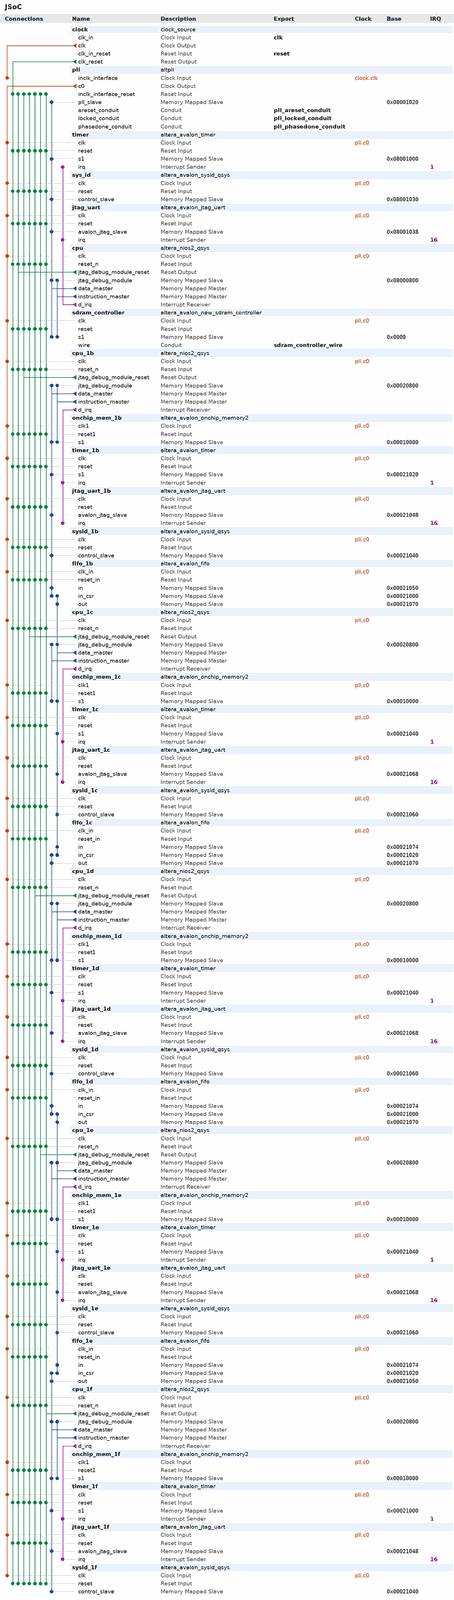
[diagram p0: system contents, whole]
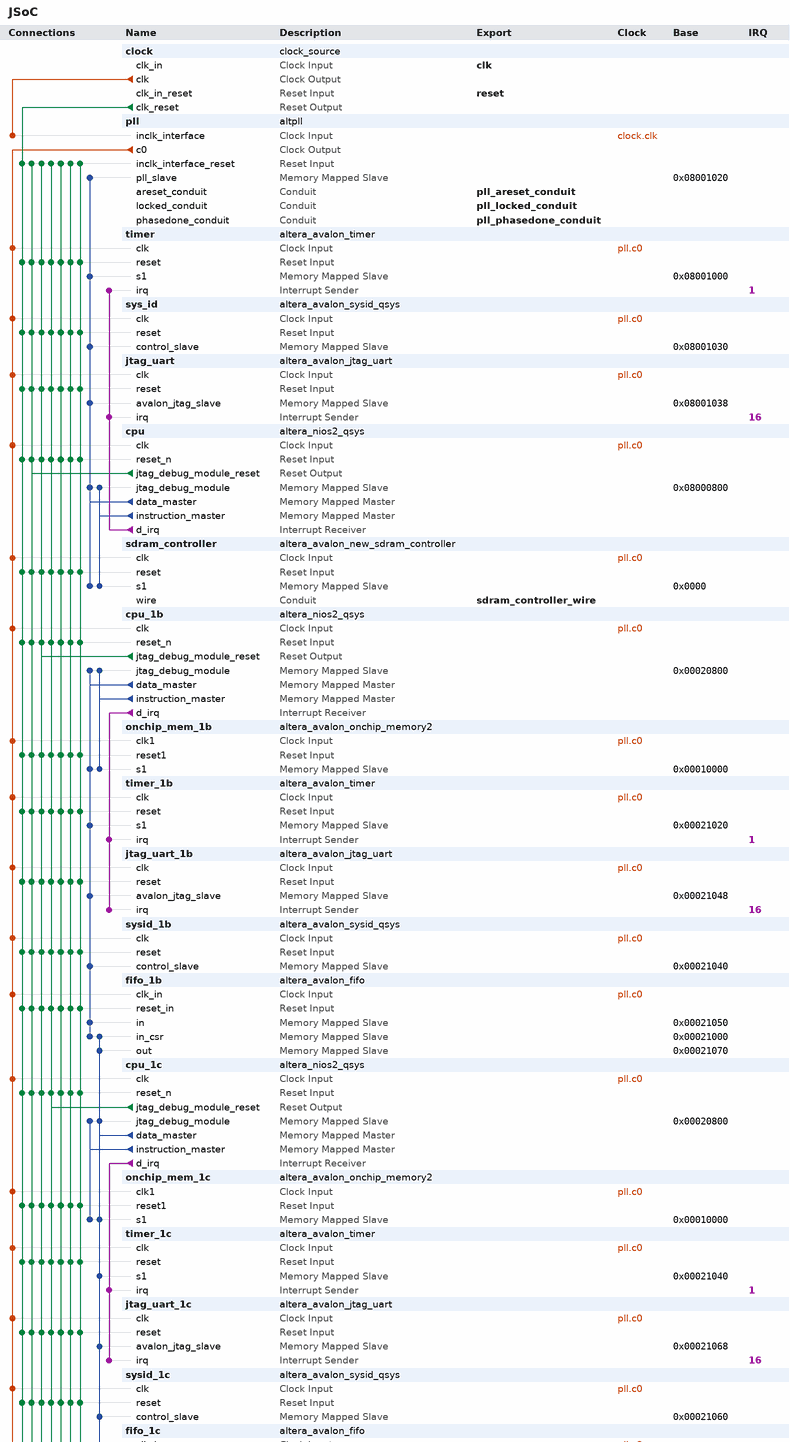
[diagram p1: system contents, upper part]
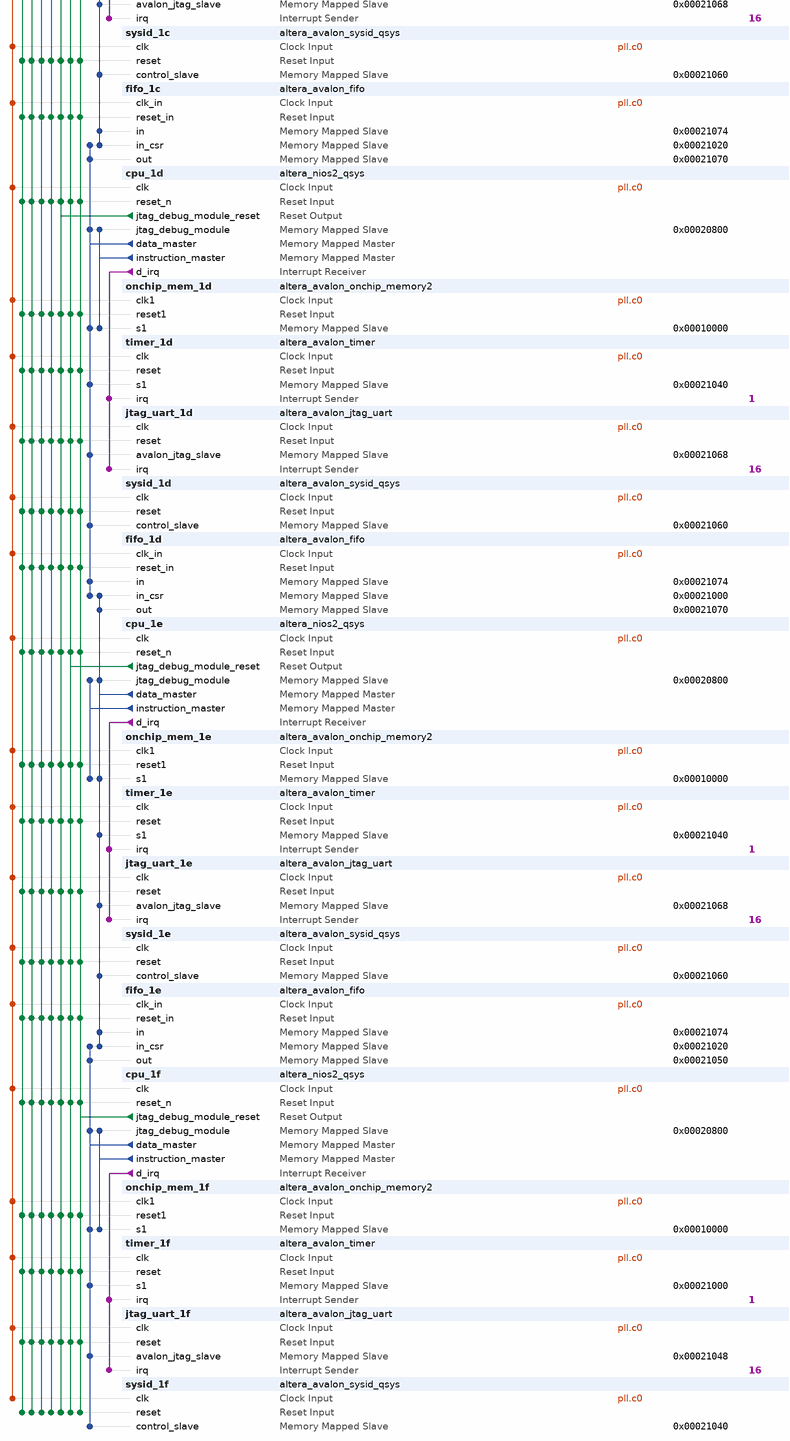
[diagram p2: system contents, lower part]
# Platform Designer (Qsys) system JSoC, Cyclone IV E EP4CE115F29C7
# Parameters at their usual value, and those the tool derives, are not listed.
package require -exact qsys 13.1
create_system JSoC
set_project_property DEVICE_FAMILY {Cyclone IV E}
set_project_property DEVICE EP4CE115F29C7

add_instance clock clock_source 13.1
set_instance_parameter_value clock clockFrequency 50000000

add_instance pll altpll 13.1
set_instance_parameter_value pll INCLK0_INPUT_FREQUENCY 20000
set_instance_parameter_value pll CLK0_MULTIPLY_BY 3
set_instance_parameter_value pll CLK1_MULTIPLY_BY 3
set_instance_parameter_value pll CLK0_DIVIDE_BY 2
set_instance_parameter_value pll CLK1_DIVIDE_BY 2
set_instance_parameter_value pll CLK1_PHASE_SHIFT -2407
set_instance_parameter_value pll CLK1_DUTY_CYCLE 50
set_instance_parameter_value pll PORT_clk1 PORT_USED
set_instance_parameter_value pll PORT_clk2 PORT_UNUSED
set_instance_parameter_value pll PORT_clk3 PORT_UNUSED
set_instance_parameter_value pll PORT_ARESET PORT_UNUSED
set_instance_parameter_value pll PORT_LOCKED PORT_UNUSED

add_instance timer altera_avalon_timer 13.1
set_instance_parameter_value timer period 1
set_instance_parameter_value timer periodUnits MSEC

add_instance sys_id altera_avalon_sysid_qsys 13.1
set_instance_parameter_value sys_id id 26

add_instance jtag_uart altera_avalon_jtag_uart 13.1
set_instance_parameter_value jtag_uart simInteractiveOptions NO_INTERACTIVE_WINDOWS

add_instance cpu altera_nios2_qsys 13.1
set_instance_parameter_value cpu resetSlave sdram_controller.s1
set_instance_parameter_value cpu mmu_TLBMissExcSlave None
set_instance_parameter_value cpu exceptionSlave sdram_controller.s1
set_instance_parameter_value cpu breakSlave cpu.jtag_debug_module
set_instance_parameter_value cpu impl Tiny
set_instance_parameter_value cpu icache_size 4096

add_instance sdram_controller altera_avalon_new_sdram_controller 13.1
set_instance_parameter_value sdram_controller TAC 6.0
set_instance_parameter_value sdram_controller TRCD 20.0
set_instance_parameter_value sdram_controller TRP 20.0
set_instance_parameter_value sdram_controller casLatency 3
set_instance_parameter_value sdram_controller columnWidth 10
set_instance_parameter_value sdram_controller dataWidth 32
set_instance_parameter_value sdram_controller generateSimulationModel false
set_instance_parameter_value sdram_controller model single_Micron_MT48LC4M32B2_7_chip
set_instance_parameter_value sdram_controller numberOfBanks 4
set_instance_parameter_value sdram_controller numberOfChipSelects 1
set_instance_parameter_value sdram_controller powerUpDelay 100.0
set_instance_parameter_value sdram_controller refreshPeriod 15.625
set_instance_parameter_value sdram_controller rowWidth 13

add_instance cpu_1b altera_nios2_qsys 13.1
set_instance_parameter_value cpu_1b resetSlave onchip_mem_1b.s1
set_instance_parameter_value cpu_1b mmu_TLBMissExcSlave None
set_instance_parameter_value cpu_1b exceptionSlave onchip_mem_1b.s1
set_instance_parameter_value cpu_1b breakSlave cpu_1b.jtag_debug_module
set_instance_parameter_value cpu_1b impl Tiny
set_instance_parameter_value cpu_1b icache_size 4096

add_instance onchip_mem_1b altera_avalon_onchip_memory2 13.1
set_instance_parameter_value onchip_mem_1b dataWidth 32
set_instance_parameter_value onchip_mem_1b dualPort false
set_instance_parameter_value onchip_mem_1b initMemContent true
set_instance_parameter_value onchip_mem_1b initializationFileName onchip_mem.hex
set_instance_parameter_value onchip_mem_1b memorySize 65536

add_instance timer_1b altera_avalon_timer 13.1
set_instance_parameter_value timer_1b period 1
set_instance_parameter_value timer_1b periodUnits MSEC

add_instance jtag_uart_1b altera_avalon_jtag_uart 13.1
set_instance_parameter_value jtag_uart_1b simInteractiveOptions NO_INTERACTIVE_WINDOWS

add_instance sysid_1b altera_avalon_sysid_qsys 13.1
set_instance_parameter_value sysid_1b id 27

add_instance fifo_1b altera_avalon_fifo 13.1
set_instance_parameter_value fifo_1b bitsPerSymbol 16
set_instance_parameter_value fifo_1b channelWidth 8
set_instance_parameter_value fifo_1b errorWidth 8
set_instance_parameter_value fifo_1b fifoDepth 32
set_instance_parameter_value fifo_1b fifoInputInterfaceOptions AVALONMM_WRITE
set_instance_parameter_value fifo_1b fifoOutputInterfaceOptions AVALONMM_READ
set_instance_parameter_value fifo_1b singleClockMode true
set_instance_parameter_value fifo_1b symbolsPerBeat 2
set_instance_parameter_value fifo_1b useIRQ false
set_instance_parameter_value fifo_1b usePacket true
set_instance_parameter_value fifo_1b useReadControl false

add_instance cpu_1c altera_nios2_qsys 13.1
set_instance_parameter_value cpu_1c resetSlave onchip_mem_1c.s1
set_instance_parameter_value cpu_1c mmu_TLBMissExcSlave None
set_instance_parameter_value cpu_1c exceptionSlave onchip_mem_1c.s1
set_instance_parameter_value cpu_1c breakSlave cpu_1c.jtag_debug_module
set_instance_parameter_value cpu_1c impl Tiny
set_instance_parameter_value cpu_1c icache_size 4096

add_instance onchip_mem_1c altera_avalon_onchip_memory2 13.1
set_instance_parameter_value onchip_mem_1c dataWidth 32
set_instance_parameter_value onchip_mem_1c dualPort false
set_instance_parameter_value onchip_mem_1c initMemContent true
set_instance_parameter_value onchip_mem_1c initializationFileName onchip_mem.hex
set_instance_parameter_value onchip_mem_1c memorySize 65536

add_instance timer_1c altera_avalon_timer 13.1
set_instance_parameter_value timer_1c period 1
set_instance_parameter_value timer_1c periodUnits MSEC

add_instance jtag_uart_1c altera_avalon_jtag_uart 13.1
set_instance_parameter_value jtag_uart_1c simInteractiveOptions NO_INTERACTIVE_WINDOWS

add_instance sysid_1c altera_avalon_sysid_qsys 13.1
set_instance_parameter_value sysid_1c id 28

add_instance fifo_1c altera_avalon_fifo 13.1
set_instance_parameter_value fifo_1c bitsPerSymbol 16
set_instance_parameter_value fifo_1c channelWidth 8
set_instance_parameter_value fifo_1c errorWidth 8
set_instance_parameter_value fifo_1c fifoDepth 32
set_instance_parameter_value fifo_1c fifoInputInterfaceOptions AVALONMM_WRITE
set_instance_parameter_value fifo_1c fifoOutputInterfaceOptions AVALONMM_READ
set_instance_parameter_value fifo_1c singleClockMode true
set_instance_parameter_value fifo_1c symbolsPerBeat 2
set_instance_parameter_value fifo_1c useIRQ false
set_instance_parameter_value fifo_1c usePacket true
set_instance_parameter_value fifo_1c useReadControl false

add_instance cpu_1d altera_nios2_qsys 13.1
set_instance_parameter_value cpu_1d resetSlave onchip_mem_1d.s1
set_instance_parameter_value cpu_1d mmu_TLBMissExcSlave None
set_instance_parameter_value cpu_1d exceptionSlave onchip_mem_1d.s1
set_instance_parameter_value cpu_1d breakSlave cpu_1d.jtag_debug_module
set_instance_parameter_value cpu_1d impl Tiny
set_instance_parameter_value cpu_1d icache_size 4096

add_instance onchip_mem_1d altera_avalon_onchip_memory2 13.1
set_instance_parameter_value onchip_mem_1d dataWidth 32
set_instance_parameter_value onchip_mem_1d dualPort false
set_instance_parameter_value onchip_mem_1d initMemContent true
set_instance_parameter_value onchip_mem_1d initializationFileName onchip_mem.hex
set_instance_parameter_value onchip_mem_1d memorySize 65536

add_instance timer_1d altera_avalon_timer 13.1
set_instance_parameter_value timer_1d period 1
set_instance_parameter_value timer_1d periodUnits MSEC

add_instance jtag_uart_1d altera_avalon_jtag_uart 13.1
set_instance_parameter_value jtag_uart_1d simInteractiveOptions NO_INTERACTIVE_WINDOWS

add_instance sysid_1d altera_avalon_sysid_qsys 13.1
set_instance_parameter_value sysid_1d id 29

add_instance fifo_1d altera_avalon_fifo 13.1
set_instance_parameter_value fifo_1d bitsPerSymbol 16
set_instance_parameter_value fifo_1d channelWidth 8
set_instance_parameter_value fifo_1d errorWidth 8
set_instance_parameter_value fifo_1d fifoDepth 32
set_instance_parameter_value fifo_1d fifoInputInterfaceOptions AVALONMM_WRITE
set_instance_parameter_value fifo_1d fifoOutputInterfaceOptions AVALONMM_READ
set_instance_parameter_value fifo_1d singleClockMode true
set_instance_parameter_value fifo_1d symbolsPerBeat 2
set_instance_parameter_value fifo_1d useIRQ false
set_instance_parameter_value fifo_1d usePacket true
set_instance_parameter_value fifo_1d useReadControl false

add_instance cpu_1e altera_nios2_qsys 13.1
set_instance_parameter_value cpu_1e resetSlave onchip_mem_1e.s1
set_instance_parameter_value cpu_1e mmu_TLBMissExcSlave None
set_instance_parameter_value cpu_1e exceptionSlave onchip_mem_1e.s1
set_instance_parameter_value cpu_1e breakSlave cpu_1e.jtag_debug_module
set_instance_parameter_value cpu_1e impl Tiny
set_instance_parameter_value cpu_1e icache_size 4096

add_instance onchip_mem_1e altera_avalon_onchip_memory2 13.1
set_instance_parameter_value onchip_mem_1e dataWidth 32
set_instance_parameter_value onchip_mem_1e dualPort false
set_instance_parameter_value onchip_mem_1e initMemContent true
set_instance_parameter_value onchip_mem_1e initializationFileName onchip_mem.hex
set_instance_parameter_value onchip_mem_1e memorySize 65536

add_instance timer_1e altera_avalon_timer 13.1
set_instance_parameter_value timer_1e period 1
set_instance_parameter_value timer_1e periodUnits MSEC

add_instance jtag_uart_1e altera_avalon_jtag_uart 13.1
set_instance_parameter_value jtag_uart_1e simInteractiveOptions NO_INTERACTIVE_WINDOWS

add_instance sysid_1e altera_avalon_sysid_qsys 13.1
set_instance_parameter_value sysid_1e id 30

add_instance fifo_1e altera_avalon_fifo 13.1
set_instance_parameter_value fifo_1e bitsPerSymbol 16
set_instance_parameter_value fifo_1e channelWidth 8
set_instance_parameter_value fifo_1e errorWidth 8
set_instance_parameter_value fifo_1e fifoDepth 32
set_instance_parameter_value fifo_1e fifoInputInterfaceOptions AVALONMM_WRITE
set_instance_parameter_value fifo_1e fifoOutputInterfaceOptions AVALONMM_READ
set_instance_parameter_value fifo_1e singleClockMode true
set_instance_parameter_value fifo_1e symbolsPerBeat 2
set_instance_parameter_value fifo_1e useIRQ false
set_instance_parameter_value fifo_1e usePacket true
set_instance_parameter_value fifo_1e useReadControl false

add_instance cpu_1f altera_nios2_qsys 13.1
set_instance_parameter_value cpu_1f resetSlave onchip_mem_1f.s1
set_instance_parameter_value cpu_1f mmu_TLBMissExcSlave None
set_instance_parameter_value cpu_1f exceptionSlave onchip_mem_1f.s1
set_instance_parameter_value cpu_1f breakSlave cpu_1f.jtag_debug_module
set_instance_parameter_value cpu_1f impl Tiny
set_instance_parameter_value cpu_1f icache_size 4096

add_instance onchip_mem_1f altera_avalon_onchip_memory2 13.1
set_instance_parameter_value onchip_mem_1f dataWidth 32
set_instance_parameter_value onchip_mem_1f dualPort false
set_instance_parameter_value onchip_mem_1f initMemContent true
set_instance_parameter_value onchip_mem_1f initializationFileName onchip_mem.hex
set_instance_parameter_value onchip_mem_1f memorySize 65536

add_instance timer_1f altera_avalon_timer 13.1
set_instance_parameter_value timer_1f period 1
set_instance_parameter_value timer_1f periodUnits MSEC

add_instance jtag_uart_1f altera_avalon_jtag_uart 13.1
set_instance_parameter_value jtag_uart_1f simInteractiveOptions NO_INTERACTIVE_WINDOWS

add_instance sysid_1f altera_avalon_sysid_qsys 13.1
set_instance_parameter_value sysid_1f id 31

# connections
add_connection clock.clk pll.inclk_interface clock
add_connection pll.c0 cpu.clk clock
add_connection pll.c0 cpu_1b.clk clock
add_connection pll.c0 cpu_1c.clk clock
add_connection pll.c0 cpu_1d.clk clock
add_connection pll.c0 cpu_1e.clk clock
add_connection pll.c0 cpu_1f.clk clock
add_connection pll.c0 fifo_1b.clk_in clock
add_connection pll.c0 fifo_1c.clk_in clock
add_connection pll.c0 fifo_1d.clk_in clock
add_connection pll.c0 fifo_1e.clk_in clock
add_connection pll.c0 jtag_uart.clk clock
add_connection pll.c0 jtag_uart_1b.clk clock
add_connection pll.c0 jtag_uart_1c.clk clock
add_connection pll.c0 jtag_uart_1d.clk clock
add_connection pll.c0 jtag_uart_1e.clk clock
add_connection pll.c0 jtag_uart_1f.clk clock
add_connection pll.c0 onchip_mem_1b.clk1 clock
add_connection pll.c0 onchip_mem_1c.clk1 clock
add_connection pll.c0 onchip_mem_1d.clk1 clock
add_connection pll.c0 onchip_mem_1e.clk1 clock
add_connection pll.c0 onchip_mem_1f.clk1 clock
add_connection pll.c0 sdram_controller.clk clock
add_connection pll.c0 sys_id.clk clock
add_connection pll.c0 sysid_1b.clk clock
add_connection pll.c0 sysid_1c.clk clock
add_connection pll.c0 sysid_1d.clk clock
add_connection pll.c0 sysid_1e.clk clock
add_connection pll.c0 sysid_1f.clk clock
add_connection pll.c0 timer.clk clock
add_connection pll.c0 timer_1b.clk clock
add_connection pll.c0 timer_1c.clk clock
add_connection pll.c0 timer_1d.clk clock
add_connection pll.c0 timer_1e.clk clock
add_connection pll.c0 timer_1f.clk clock
add_connection clock.clk_reset cpu.reset_n reset
add_connection clock.clk_reset cpu_1b.reset_n reset
add_connection clock.clk_reset cpu_1c.reset_n reset
add_connection clock.clk_reset cpu_1d.reset_n reset
add_connection clock.clk_reset cpu_1e.reset_n reset
add_connection clock.clk_reset cpu_1f.reset_n reset
add_connection clock.clk_reset fifo_1b.reset_in reset
add_connection clock.clk_reset fifo_1c.reset_in reset
add_connection clock.clk_reset fifo_1d.reset_in reset
add_connection clock.clk_reset fifo_1e.reset_in reset
add_connection clock.clk_reset jtag_uart.reset reset
add_connection clock.clk_reset jtag_uart_1b.reset reset
add_connection clock.clk_reset jtag_uart_1c.reset reset
add_connection clock.clk_reset jtag_uart_1d.reset reset
add_connection clock.clk_reset jtag_uart_1e.reset reset
add_connection clock.clk_reset jtag_uart_1f.reset reset
add_connection clock.clk_reset onchip_mem_1b.reset1 reset
add_connection clock.clk_reset onchip_mem_1c.reset1 reset
add_connection clock.clk_reset onchip_mem_1d.reset1 reset
add_connection clock.clk_reset onchip_mem_1e.reset1 reset
add_connection clock.clk_reset onchip_mem_1f.reset1 reset
add_connection clock.clk_reset pll.inclk_interface_reset reset
add_connection clock.clk_reset sdram_controller.reset reset
add_connection clock.clk_reset sys_id.reset reset
add_connection clock.clk_reset sysid_1b.reset reset
add_connection clock.clk_reset sysid_1c.reset reset
add_connection clock.clk_reset sysid_1d.reset reset
add_connection clock.clk_reset sysid_1e.reset reset
add_connection clock.clk_reset sysid_1f.reset reset
add_connection clock.clk_reset timer.reset reset
add_connection clock.clk_reset timer_1b.reset reset
add_connection clock.clk_reset timer_1c.reset reset
add_connection clock.clk_reset timer_1d.reset reset
add_connection clock.clk_reset timer_1e.reset reset
add_connection clock.clk_reset timer_1f.reset reset
add_connection cpu.jtag_debug_module_reset cpu.reset_n reset
add_connection cpu.jtag_debug_module_reset cpu_1b.reset_n reset
add_connection cpu.jtag_debug_module_reset cpu_1c.reset_n reset
add_connection cpu.jtag_debug_module_reset cpu_1d.reset_n reset
add_connection cpu.jtag_debug_module_reset cpu_1e.reset_n reset
add_connection cpu.jtag_debug_module_reset cpu_1f.reset_n reset
add_connection cpu.jtag_debug_module_reset fifo_1b.reset_in reset
add_connection cpu.jtag_debug_module_reset fifo_1c.reset_in reset
add_connection cpu.jtag_debug_module_reset fifo_1d.reset_in reset
add_connection cpu.jtag_debug_module_reset fifo_1e.reset_in reset
add_connection cpu.jtag_debug_module_reset jtag_uart.reset reset
add_connection cpu.jtag_debug_module_reset jtag_uart_1b.reset reset
add_connection cpu.jtag_debug_module_reset jtag_uart_1c.reset reset
add_connection cpu.jtag_debug_module_reset jtag_uart_1d.reset reset
add_connection cpu.jtag_debug_module_reset jtag_uart_1e.reset reset
add_connection cpu.jtag_debug_module_reset jtag_uart_1f.reset reset
add_connection cpu.jtag_debug_module_reset onchip_mem_1b.reset1 reset
add_connection cpu.jtag_debug_module_reset onchip_mem_1c.reset1 reset
add_connection cpu.jtag_debug_module_reset onchip_mem_1d.reset1 reset
add_connection cpu.jtag_debug_module_reset onchip_mem_1e.reset1 reset
add_connection cpu.jtag_debug_module_reset onchip_mem_1f.reset1 reset
add_connection cpu.jtag_debug_module_reset pll.inclk_interface_reset reset
add_connection cpu.jtag_debug_module_reset sdram_controller.reset reset
add_connection cpu.jtag_debug_module_reset sys_id.reset reset
add_connection cpu.jtag_debug_module_reset sysid_1b.reset reset
add_connection cpu.jtag_debug_module_reset sysid_1c.reset reset
add_connection cpu.jtag_debug_module_reset sysid_1d.reset reset
add_connection cpu.jtag_debug_module_reset sysid_1e.reset reset
add_connection cpu.jtag_debug_module_reset sysid_1f.reset reset
add_connection cpu.jtag_debug_module_reset timer.reset reset
add_connection cpu.jtag_debug_module_reset timer_1b.reset reset
add_connection cpu.jtag_debug_module_reset timer_1c.reset reset
add_connection cpu.jtag_debug_module_reset timer_1d.reset reset
add_connection cpu.jtag_debug_module_reset timer_1e.reset reset
add_connection cpu.jtag_debug_module_reset timer_1f.reset reset
add_connection cpu_1b.jtag_debug_module_reset cpu.reset_n reset
add_connection cpu_1b.jtag_debug_module_reset cpu_1b.reset_n reset
add_connection cpu_1b.jtag_debug_module_reset cpu_1c.reset_n reset
add_connection cpu_1b.jtag_debug_module_reset cpu_1d.reset_n reset
add_connection cpu_1b.jtag_debug_module_reset cpu_1e.reset_n reset
add_connection cpu_1b.jtag_debug_module_reset cpu_1f.reset_n reset
add_connection cpu_1b.jtag_debug_module_reset fifo_1b.reset_in reset
add_connection cpu_1b.jtag_debug_module_reset fifo_1c.reset_in reset
add_connection cpu_1b.jtag_debug_module_reset fifo_1d.reset_in reset
add_connection cpu_1b.jtag_debug_module_reset fifo_1e.reset_in reset
add_connection cpu_1b.jtag_debug_module_reset jtag_uart.reset reset
add_connection cpu_1b.jtag_debug_module_reset jtag_uart_1b.reset reset
add_connection cpu_1b.jtag_debug_module_reset jtag_uart_1c.reset reset
add_connection cpu_1b.jtag_debug_module_reset jtag_uart_1d.reset reset
add_connection cpu_1b.jtag_debug_module_reset jtag_uart_1e.reset reset
add_connection cpu_1b.jtag_debug_module_reset jtag_uart_1f.reset reset
add_connection cpu_1b.jtag_debug_module_reset onchip_mem_1b.reset1 reset
add_connection cpu_1b.jtag_debug_module_reset onchip_mem_1c.reset1 reset
add_connection cpu_1b.jtag_debug_module_reset onchip_mem_1d.reset1 reset
add_connection cpu_1b.jtag_debug_module_reset onchip_mem_1e.reset1 reset
add_connection cpu_1b.jtag_debug_module_reset onchip_mem_1f.reset1 reset
add_connection cpu_1b.jtag_debug_module_reset pll.inclk_interface_reset reset
add_connection cpu_1b.jtag_debug_module_reset sdram_controller.reset reset
add_connection cpu_1b.jtag_debug_module_reset sys_id.reset reset
add_connection cpu_1b.jtag_debug_module_reset sysid_1b.reset reset
add_connection cpu_1b.jtag_debug_module_reset sysid_1c.reset reset
add_connection cpu_1b.jtag_debug_module_reset sysid_1d.reset reset
add_connection cpu_1b.jtag_debug_module_reset sysid_1e.reset reset
add_connection cpu_1b.jtag_debug_module_reset sysid_1f.reset reset
add_connection cpu_1b.jtag_debug_module_reset timer.reset reset
add_connection cpu_1b.jtag_debug_module_reset timer_1b.reset reset
add_connection cpu_1b.jtag_debug_module_reset timer_1c.reset reset
add_connection cpu_1b.jtag_debug_module_reset timer_1d.reset reset
add_connection cpu_1b.jtag_debug_module_reset timer_1e.reset reset
add_connection cpu_1b.jtag_debug_module_reset timer_1f.reset reset
add_connection cpu_1c.jtag_debug_module_reset cpu.reset_n reset
add_connection cpu_1c.jtag_debug_module_reset cpu_1b.reset_n reset
add_connection cpu_1c.jtag_debug_module_reset cpu_1c.reset_n reset
add_connection cpu_1c.jtag_debug_module_reset cpu_1d.reset_n reset
add_connection cpu_1c.jtag_debug_module_reset cpu_1e.reset_n reset
add_connection cpu_1c.jtag_debug_module_reset cpu_1f.reset_n reset
add_connection cpu_1c.jtag_debug_module_reset fifo_1b.reset_in reset
add_connection cpu_1c.jtag_debug_module_reset fifo_1c.reset_in reset
add_connection cpu_1c.jtag_debug_module_reset fifo_1d.reset_in reset
add_connection cpu_1c.jtag_debug_module_reset fifo_1e.reset_in reset
add_connection cpu_1c.jtag_debug_module_reset jtag_uart.reset reset
add_connection cpu_1c.jtag_debug_module_reset jtag_uart_1b.reset reset
add_connection cpu_1c.jtag_debug_module_reset jtag_uart_1c.reset reset
add_connection cpu_1c.jtag_debug_module_reset jtag_uart_1d.reset reset
add_connection cpu_1c.jtag_debug_module_reset jtag_uart_1e.reset reset
add_connection cpu_1c.jtag_debug_module_reset jtag_uart_1f.reset reset
add_connection cpu_1c.jtag_debug_module_reset onchip_mem_1b.reset1 reset
add_connection cpu_1c.jtag_debug_module_reset onchip_mem_1c.reset1 reset
add_connection cpu_1c.jtag_debug_module_reset onchip_mem_1d.reset1 reset
add_connection cpu_1c.jtag_debug_module_reset onchip_mem_1e.reset1 reset
add_connection cpu_1c.jtag_debug_module_reset onchip_mem_1f.reset1 reset
add_connection cpu_1c.jtag_debug_module_reset pll.inclk_interface_reset reset
add_connection cpu_1c.jtag_debug_module_reset sdram_controller.reset reset
add_connection cpu_1c.jtag_debug_module_reset sys_id.reset reset
add_connection cpu_1c.jtag_debug_module_reset sysid_1b.reset reset
add_connection cpu_1c.jtag_debug_module_reset sysid_1c.reset reset
add_connection cpu_1c.jtag_debug_module_reset sysid_1d.reset reset
add_connection cpu_1c.jtag_debug_module_reset sysid_1e.reset reset
add_connection cpu_1c.jtag_debug_module_reset sysid_1f.reset reset
add_connection cpu_1c.jtag_debug_module_reset timer.reset reset
add_connection cpu_1c.jtag_debug_module_reset timer_1b.reset reset
add_connection cpu_1c.jtag_debug_module_reset timer_1c.reset reset
add_connection cpu_1c.jtag_debug_module_reset timer_1d.reset reset
add_connection cpu_1c.jtag_debug_module_reset timer_1e.reset reset
add_connection cpu_1c.jtag_debug_module_reset timer_1f.reset reset
add_connection cpu_1d.jtag_debug_module_reset cpu.reset_n reset
add_connection cpu_1d.jtag_debug_module_reset cpu_1b.reset_n reset
add_connection cpu_1d.jtag_debug_module_reset cpu_1c.reset_n reset
add_connection cpu_1d.jtag_debug_module_reset cpu_1d.reset_n reset
add_connection cpu_1d.jtag_debug_module_reset cpu_1e.reset_n reset
add_connection cpu_1d.jtag_debug_module_reset cpu_1f.reset_n reset
add_connection cpu_1d.jtag_debug_module_reset fifo_1b.reset_in reset
add_connection cpu_1d.jtag_debug_module_reset fifo_1c.reset_in reset
add_connection cpu_1d.jtag_debug_module_reset fifo_1d.reset_in reset
add_connection cpu_1d.jtag_debug_module_reset fifo_1e.reset_in reset
add_connection cpu_1d.jtag_debug_module_reset jtag_uart.reset reset
add_connection cpu_1d.jtag_debug_module_reset jtag_uart_1b.reset reset
add_connection cpu_1d.jtag_debug_module_reset jtag_uart_1c.reset reset
add_connection cpu_1d.jtag_debug_module_reset jtag_uart_1d.reset reset
add_connection cpu_1d.jtag_debug_module_reset jtag_uart_1e.reset reset
add_connection cpu_1d.jtag_debug_module_reset jtag_uart_1f.reset reset
add_connection cpu_1d.jtag_debug_module_reset onchip_mem_1b.reset1 reset
add_connection cpu_1d.jtag_debug_module_reset onchip_mem_1c.reset1 reset
add_connection cpu_1d.jtag_debug_module_reset onchip_mem_1d.reset1 reset
add_connection cpu_1d.jtag_debug_module_reset onchip_mem_1e.reset1 reset
add_connection cpu_1d.jtag_debug_module_reset onchip_mem_1f.reset1 reset
add_connection cpu_1d.jtag_debug_module_reset pll.inclk_interface_reset reset
add_connection cpu_1d.jtag_debug_module_reset sdram_controller.reset reset
add_connection cpu_1d.jtag_debug_module_reset sys_id.reset reset
add_connection cpu_1d.jtag_debug_module_reset sysid_1b.reset reset
add_connection cpu_1d.jtag_debug_module_reset sysid_1c.reset reset
add_connection cpu_1d.jtag_debug_module_reset sysid_1d.reset reset
add_connection cpu_1d.jtag_debug_module_reset sysid_1e.reset reset
add_connection cpu_1d.jtag_debug_module_reset sysid_1f.reset reset
add_connection cpu_1d.jtag_debug_module_reset timer.reset reset
add_connection cpu_1d.jtag_debug_module_reset timer_1b.reset reset
add_connection cpu_1d.jtag_debug_module_reset timer_1c.reset reset
add_connection cpu_1d.jtag_debug_module_reset timer_1d.reset reset
add_connection cpu_1d.jtag_debug_module_reset timer_1e.reset reset
add_connection cpu_1d.jtag_debug_module_reset timer_1f.reset reset
add_connection cpu_1e.jtag_debug_module_reset cpu.reset_n reset
add_connection cpu_1e.jtag_debug_module_reset cpu_1b.reset_n reset
add_connection cpu_1e.jtag_debug_module_reset cpu_1c.reset_n reset
add_connection cpu_1e.jtag_debug_module_reset cpu_1d.reset_n reset
add_connection cpu_1e.jtag_debug_module_reset cpu_1e.reset_n reset
add_connection cpu_1e.jtag_debug_module_reset cpu_1f.reset_n reset
add_connection cpu_1e.jtag_debug_module_reset fifo_1b.reset_in reset
add_connection cpu_1e.jtag_debug_module_reset fifo_1c.reset_in reset
add_connection cpu_1e.jtag_debug_module_reset fifo_1d.reset_in reset
add_connection cpu_1e.jtag_debug_module_reset fifo_1e.reset_in reset
add_connection cpu_1e.jtag_debug_module_reset jtag_uart.reset reset
add_connection cpu_1e.jtag_debug_module_reset jtag_uart_1b.reset reset
add_connection cpu_1e.jtag_debug_module_reset jtag_uart_1c.reset reset
add_connection cpu_1e.jtag_debug_module_reset jtag_uart_1d.reset reset
add_connection cpu_1e.jtag_debug_module_reset jtag_uart_1e.reset reset
add_connection cpu_1e.jtag_debug_module_reset jtag_uart_1f.reset reset
add_connection cpu_1e.jtag_debug_module_reset onchip_mem_1b.reset1 reset
add_connection cpu_1e.jtag_debug_module_reset onchip_mem_1c.reset1 reset
add_connection cpu_1e.jtag_debug_module_reset onchip_mem_1d.reset1 reset
add_connection cpu_1e.jtag_debug_module_reset onchip_mem_1e.reset1 reset
add_connection cpu_1e.jtag_debug_module_reset onchip_mem_1f.reset1 reset
add_connection cpu_1e.jtag_debug_module_reset pll.inclk_interface_reset reset
add_connection cpu_1e.jtag_debug_module_reset sdram_controller.reset reset
add_connection cpu_1e.jtag_debug_module_reset sys_id.reset reset
add_connection cpu_1e.jtag_debug_module_reset sysid_1b.reset reset
add_connection cpu_1e.jtag_debug_module_reset sysid_1c.reset reset
add_connection cpu_1e.jtag_debug_module_reset sysid_1d.reset reset
add_connection cpu_1e.jtag_debug_module_reset sysid_1e.reset reset
add_connection cpu_1e.jtag_debug_module_reset sysid_1f.reset reset
add_connection cpu_1e.jtag_debug_module_reset timer.reset reset
add_connection cpu_1e.jtag_debug_module_reset timer_1b.reset reset
add_connection cpu_1e.jtag_debug_module_reset timer_1c.reset reset
add_connection cpu_1e.jtag_debug_module_reset timer_1d.reset reset
add_connection cpu_1e.jtag_debug_module_reset timer_1e.reset reset
add_connection cpu_1e.jtag_debug_module_reset timer_1f.reset reset
add_connection cpu_1f.jtag_debug_module_reset cpu.reset_n reset
add_connection cpu_1f.jtag_debug_module_reset cpu_1b.reset_n reset
add_connection cpu_1f.jtag_debug_module_reset cpu_1c.reset_n reset
add_connection cpu_1f.jtag_debug_module_reset cpu_1d.reset_n reset
add_connection cpu_1f.jtag_debug_module_reset cpu_1e.reset_n reset
add_connection cpu_1f.jtag_debug_module_reset cpu_1f.reset_n reset
add_connection cpu_1f.jtag_debug_module_reset fifo_1b.reset_in reset
add_connection cpu_1f.jtag_debug_module_reset fifo_1c.reset_in reset
add_connection cpu_1f.jtag_debug_module_reset fifo_1d.reset_in reset
add_connection cpu_1f.jtag_debug_module_reset fifo_1e.reset_in reset
add_connection cpu_1f.jtag_debug_module_reset jtag_uart.reset reset
add_connection cpu_1f.jtag_debug_module_reset jtag_uart_1b.reset reset
add_connection cpu_1f.jtag_debug_module_reset jtag_uart_1c.reset reset
add_connection cpu_1f.jtag_debug_module_reset jtag_uart_1d.reset reset
add_connection cpu_1f.jtag_debug_module_reset jtag_uart_1e.reset reset
add_connection cpu_1f.jtag_debug_module_reset jtag_uart_1f.reset reset
add_connection cpu_1f.jtag_debug_module_reset onchip_mem_1b.reset1 reset
add_connection cpu_1f.jtag_debug_module_reset onchip_mem_1c.reset1 reset
add_connection cpu_1f.jtag_debug_module_reset onchip_mem_1d.reset1 reset
add_connection cpu_1f.jtag_debug_module_reset onchip_mem_1e.reset1 reset
add_connection cpu_1f.jtag_debug_module_reset onchip_mem_1f.reset1 reset
add_connection cpu_1f.jtag_debug_module_reset pll.inclk_interface_reset reset
add_connection cpu_1f.jtag_debug_module_reset sdram_controller.reset reset
add_connection cpu_1f.jtag_debug_module_reset sys_id.reset reset
add_connection cpu_1f.jtag_debug_module_reset sysid_1b.reset reset
add_connection cpu_1f.jtag_debug_module_reset sysid_1c.reset reset
add_connection cpu_1f.jtag_debug_module_reset sysid_1d.reset reset
add_connection cpu_1f.jtag_debug_module_reset sysid_1e.reset reset
add_connection cpu_1f.jtag_debug_module_reset sysid_1f.reset reset
add_connection cpu_1f.jtag_debug_module_reset timer.reset reset
add_connection cpu_1f.jtag_debug_module_reset timer_1b.reset reset
add_connection cpu_1f.jtag_debug_module_reset timer_1c.reset reset
add_connection cpu_1f.jtag_debug_module_reset timer_1d.reset reset
add_connection cpu_1f.jtag_debug_module_reset timer_1e.reset reset
add_connection cpu_1f.jtag_debug_module_reset timer_1f.reset reset
add_connection cpu.data_master cpu.jtag_debug_module avalon
set_connection_parameter_value cpu.data_master/cpu.jtag_debug_module baseAddress 0x08000800
add_connection cpu.data_master jtag_uart.avalon_jtag_slave avalon
set_connection_parameter_value cpu.data_master/jtag_uart.avalon_jtag_slave baseAddress 0x08001038
add_connection cpu.data_master pll.pll_slave avalon
set_connection_parameter_value cpu.data_master/pll.pll_slave baseAddress 0x08001020
add_connection cpu.data_master sdram_controller.s1 avalon
set_connection_parameter_value cpu.data_master/sdram_controller.s1 baseAddress 0x0000
add_connection cpu.data_master sys_id.control_slave avalon
set_connection_parameter_value cpu.data_master/sys_id.control_slave baseAddress 0x08001030
add_connection cpu.data_master timer.s1 avalon
set_connection_parameter_value cpu.data_master/timer.s1 baseAddress 0x08001000
add_connection cpu.instruction_master cpu.jtag_debug_module avalon
set_connection_parameter_value cpu.instruction_master/cpu.jtag_debug_module baseAddress 0x08000800
add_connection cpu.instruction_master sdram_controller.s1 avalon
set_connection_parameter_value cpu.instruction_master/sdram_controller.s1 baseAddress 0x0000
add_connection cpu_1b.data_master cpu_1b.jtag_debug_module avalon
set_connection_parameter_value cpu_1b.data_master/cpu_1b.jtag_debug_module baseAddress 0x00020800
add_connection cpu_1b.data_master fifo_1b.in avalon
set_connection_parameter_value cpu_1b.data_master/fifo_1b.in baseAddress 0x00021050
add_connection cpu_1b.data_master fifo_1b.in_csr avalon
set_connection_parameter_value cpu_1b.data_master/fifo_1b.in_csr baseAddress 0x00021000
add_connection cpu_1b.data_master jtag_uart_1b.avalon_jtag_slave avalon
set_connection_parameter_value cpu_1b.data_master/jtag_uart_1b.avalon_jtag_slave baseAddress 0x00021048
add_connection cpu_1b.data_master onchip_mem_1b.s1 avalon
set_connection_parameter_value cpu_1b.data_master/onchip_mem_1b.s1 baseAddress 0x00010000
add_connection cpu_1b.data_master sysid_1b.control_slave avalon
set_connection_parameter_value cpu_1b.data_master/sysid_1b.control_slave baseAddress 0x00021040
add_connection cpu_1b.data_master timer_1b.s1 avalon
set_connection_parameter_value cpu_1b.data_master/timer_1b.s1 baseAddress 0x00021020
add_connection cpu_1b.instruction_master cpu_1b.jtag_debug_module avalon
set_connection_parameter_value cpu_1b.instruction_master/cpu_1b.jtag_debug_module baseAddress 0x00020800
add_connection cpu_1b.instruction_master onchip_mem_1b.s1 avalon
set_connection_parameter_value cpu_1b.instruction_master/onchip_mem_1b.s1 baseAddress 0x00010000
add_connection cpu_1c.data_master cpu_1c.jtag_debug_module avalon
set_connection_parameter_value cpu_1c.data_master/cpu_1c.jtag_debug_module baseAddress 0x00020800
add_connection cpu_1c.data_master fifo_1b.in_csr avalon
set_connection_parameter_value cpu_1c.data_master/fifo_1b.in_csr baseAddress 0x00021000
add_connection cpu_1c.data_master fifo_1b.out avalon
set_connection_parameter_value cpu_1c.data_master/fifo_1b.out baseAddress 0x00021070
add_connection cpu_1c.data_master fifo_1c.in avalon
set_connection_parameter_value cpu_1c.data_master/fifo_1c.in baseAddress 0x00021074
add_connection cpu_1c.data_master fifo_1c.in_csr avalon
set_connection_parameter_value cpu_1c.data_master/fifo_1c.in_csr baseAddress 0x00021020
add_connection cpu_1c.data_master jtag_uart_1c.avalon_jtag_slave avalon
set_connection_parameter_value cpu_1c.data_master/jtag_uart_1c.avalon_jtag_slave baseAddress 0x00021068
add_connection cpu_1c.data_master onchip_mem_1c.s1 avalon
set_connection_parameter_value cpu_1c.data_master/onchip_mem_1c.s1 baseAddress 0x00010000
add_connection cpu_1c.data_master sysid_1c.control_slave avalon
set_connection_parameter_value cpu_1c.data_master/sysid_1c.control_slave baseAddress 0x00021060
add_connection cpu_1c.data_master timer_1c.s1 avalon
set_connection_parameter_value cpu_1c.data_master/timer_1c.s1 baseAddress 0x00021040
add_connection cpu_1c.instruction_master cpu_1c.jtag_debug_module avalon
set_connection_parameter_value cpu_1c.instruction_master/cpu_1c.jtag_debug_module baseAddress 0x00020800
add_connection cpu_1c.instruction_master onchip_mem_1c.s1 avalon
set_connection_parameter_value cpu_1c.instruction_master/onchip_mem_1c.s1 baseAddress 0x00010000
add_connection cpu_1d.data_master cpu_1d.jtag_debug_module avalon
set_connection_parameter_value cpu_1d.data_master/cpu_1d.jtag_debug_module baseAddress 0x00020800
add_connection cpu_1d.data_master fifo_1c.in_csr avalon
set_connection_parameter_value cpu_1d.data_master/fifo_1c.in_csr baseAddress 0x00021020
add_connection cpu_1d.data_master fifo_1c.out avalon
set_connection_parameter_value cpu_1d.data_master/fifo_1c.out baseAddress 0x00021070
add_connection cpu_1d.data_master fifo_1d.in avalon
set_connection_parameter_value cpu_1d.data_master/fifo_1d.in baseAddress 0x00021074
add_connection cpu_1d.data_master fifo_1d.in_csr avalon
set_connection_parameter_value cpu_1d.data_master/fifo_1d.in_csr baseAddress 0x00021000
add_connection cpu_1d.data_master jtag_uart_1d.avalon_jtag_slave avalon
set_connection_parameter_value cpu_1d.data_master/jtag_uart_1d.avalon_jtag_slave baseAddress 0x00021068
add_connection cpu_1d.data_master onchip_mem_1d.s1 avalon
set_connection_parameter_value cpu_1d.data_master/onchip_mem_1d.s1 baseAddress 0x00010000
add_connection cpu_1d.data_master sysid_1d.control_slave avalon
set_connection_parameter_value cpu_1d.data_master/sysid_1d.control_slave baseAddress 0x00021060
add_connection cpu_1d.data_master timer_1d.s1 avalon
set_connection_parameter_value cpu_1d.data_master/timer_1d.s1 baseAddress 0x00021040
add_connection cpu_1d.instruction_master cpu_1d.jtag_debug_module avalon
set_connection_parameter_value cpu_1d.instruction_master/cpu_1d.jtag_debug_module baseAddress 0x00020800
add_connection cpu_1d.instruction_master onchip_mem_1d.s1 avalon
set_connection_parameter_value cpu_1d.instruction_master/onchip_mem_1d.s1 baseAddress 0x00010000
add_connection cpu_1e.data_master cpu_1e.jtag_debug_module avalon
set_connection_parameter_value cpu_1e.data_master/cpu_1e.jtag_debug_module baseAddress 0x00020800
add_connection cpu_1e.data_master fifo_1d.in_csr avalon
set_connection_parameter_value cpu_1e.data_master/fifo_1d.in_csr baseAddress 0x00021000
add_connection cpu_1e.data_master fifo_1d.out avalon
set_connection_parameter_value cpu_1e.data_master/fifo_1d.out baseAddress 0x00021070
add_connection cpu_1e.data_master fifo_1e.in avalon
set_connection_parameter_value cpu_1e.data_master/fifo_1e.in baseAddress 0x00021074
add_connection cpu_1e.data_master fifo_1e.in_csr avalon
set_connection_parameter_value cpu_1e.data_master/fifo_1e.in_csr baseAddress 0x00021020
add_connection cpu_1e.data_master jtag_uart_1e.avalon_jtag_slave avalon
set_connection_parameter_value cpu_1e.data_master/jtag_uart_1e.avalon_jtag_slave baseAddress 0x00021068
add_connection cpu_1e.data_master onchip_mem_1e.s1 avalon
set_connection_parameter_value cpu_1e.data_master/onchip_mem_1e.s1 baseAddress 0x00010000
add_connection cpu_1e.data_master sysid_1e.control_slave avalon
set_connection_parameter_value cpu_1e.data_master/sysid_1e.control_slave baseAddress 0x00021060
add_connection cpu_1e.data_master timer_1e.s1 avalon
set_connection_parameter_value cpu_1e.data_master/timer_1e.s1 baseAddress 0x00021040
add_connection cpu_1e.instruction_master cpu_1e.jtag_debug_module avalon
set_connection_parameter_value cpu_1e.instruction_master/cpu_1e.jtag_debug_module baseAddress 0x00020800
add_connection cpu_1e.instruction_master onchip_mem_1e.s1 avalon
set_connection_parameter_value cpu_1e.instruction_master/onchip_mem_1e.s1 baseAddress 0x00010000
add_connection cpu_1f.data_master cpu_1f.jtag_debug_module avalon
set_connection_parameter_value cpu_1f.data_master/cpu_1f.jtag_debug_module baseAddress 0x00020800
add_connection cpu_1f.data_master fifo_1e.in_csr avalon
set_connection_parameter_value cpu_1f.data_master/fifo_1e.in_csr baseAddress 0x00021020
add_connection cpu_1f.data_master fifo_1e.out avalon
set_connection_parameter_value cpu_1f.data_master/fifo_1e.out baseAddress 0x00021050
add_connection cpu_1f.data_master jtag_uart_1f.avalon_jtag_slave avalon
set_connection_parameter_value cpu_1f.data_master/jtag_uart_1f.avalon_jtag_slave baseAddress 0x00021048
add_connection cpu_1f.data_master onchip_mem_1f.s1 avalon
set_connection_parameter_value cpu_1f.data_master/onchip_mem_1f.s1 baseAddress 0x00010000
add_connection cpu_1f.data_master sysid_1f.control_slave avalon
set_connection_parameter_value cpu_1f.data_master/sysid_1f.control_slave baseAddress 0x00021040
add_connection cpu_1f.data_master timer_1f.s1 avalon
set_connection_parameter_value cpu_1f.data_master/timer_1f.s1 baseAddress 0x00021000
add_connection cpu_1f.instruction_master cpu_1f.jtag_debug_module avalon
set_connection_parameter_value cpu_1f.instruction_master/cpu_1f.jtag_debug_module baseAddress 0x00020800
add_connection cpu_1f.instruction_master onchip_mem_1f.s1 avalon
set_connection_parameter_value cpu_1f.instruction_master/onchip_mem_1f.s1 baseAddress 0x00010000
add_connection cpu.d_irq jtag_uart.irq interrupt
set_connection_parameter_value cpu.d_irq/jtag_uart.irq irqNumber 16
add_connection cpu.d_irq timer.irq interrupt
set_connection_parameter_value cpu.d_irq/timer.irq irqNumber 1
add_connection cpu_1b.d_irq jtag_uart_1b.irq interrupt
set_connection_parameter_value cpu_1b.d_irq/jtag_uart_1b.irq irqNumber 16
add_connection cpu_1b.d_irq timer_1b.irq interrupt
set_connection_parameter_value cpu_1b.d_irq/timer_1b.irq irqNumber 1
add_connection cpu_1c.d_irq jtag_uart_1c.irq interrupt
set_connection_parameter_value cpu_1c.d_irq/jtag_uart_1c.irq irqNumber 16
add_connection cpu_1c.d_irq timer_1c.irq interrupt
set_connection_parameter_value cpu_1c.d_irq/timer_1c.irq irqNumber 1
add_connection cpu_1d.d_irq jtag_uart_1d.irq interrupt
set_connection_parameter_value cpu_1d.d_irq/jtag_uart_1d.irq irqNumber 16
add_connection cpu_1d.d_irq timer_1d.irq interrupt
set_connection_parameter_value cpu_1d.d_irq/timer_1d.irq irqNumber 1
add_connection cpu_1e.d_irq jtag_uart_1e.irq interrupt
set_connection_parameter_value cpu_1e.d_irq/jtag_uart_1e.irq irqNumber 16
add_connection cpu_1e.d_irq timer_1e.irq interrupt
set_connection_parameter_value cpu_1e.d_irq/timer_1e.irq irqNumber 1
add_connection cpu_1f.d_irq jtag_uart_1f.irq interrupt
set_connection_parameter_value cpu_1f.d_irq/jtag_uart_1f.irq irqNumber 16
add_connection cpu_1f.d_irq timer_1f.irq interrupt
set_connection_parameter_value cpu_1f.d_irq/timer_1f.irq irqNumber 1

# exported interfaces
add_interface clk clock sink
set_interface_property clk EXPORT_OF clock.clk_in
add_interface reset reset sink
set_interface_property reset EXPORT_OF clock.clk_in_reset
add_interface sdram_controller_wire conduit end
set_interface_property sdram_controller_wire EXPORT_OF sdram_controller.wire
add_interface pll_areset_conduit conduit end
set_interface_property pll_areset_conduit EXPORT_OF pll.areset_conduit
add_interface pll_locked_conduit conduit end
set_interface_property pll_locked_conduit EXPORT_OF pll.locked_conduit
add_interface pll_phasedone_conduit conduit end
set_interface_property pll_phasedone_conduit EXPORT_OF pll.phasedone_conduit

set_interconnect_requirement {$system} qsys_mm.clockCrossingAdapter HANDSHAKE
set_interconnect_requirement {$system} qsys_mm.maxAdditionalLatency 1
set_interconnect_requirement {$system} qsys_mm.insertDefaultSlave false

save_system JSoC.qsys
